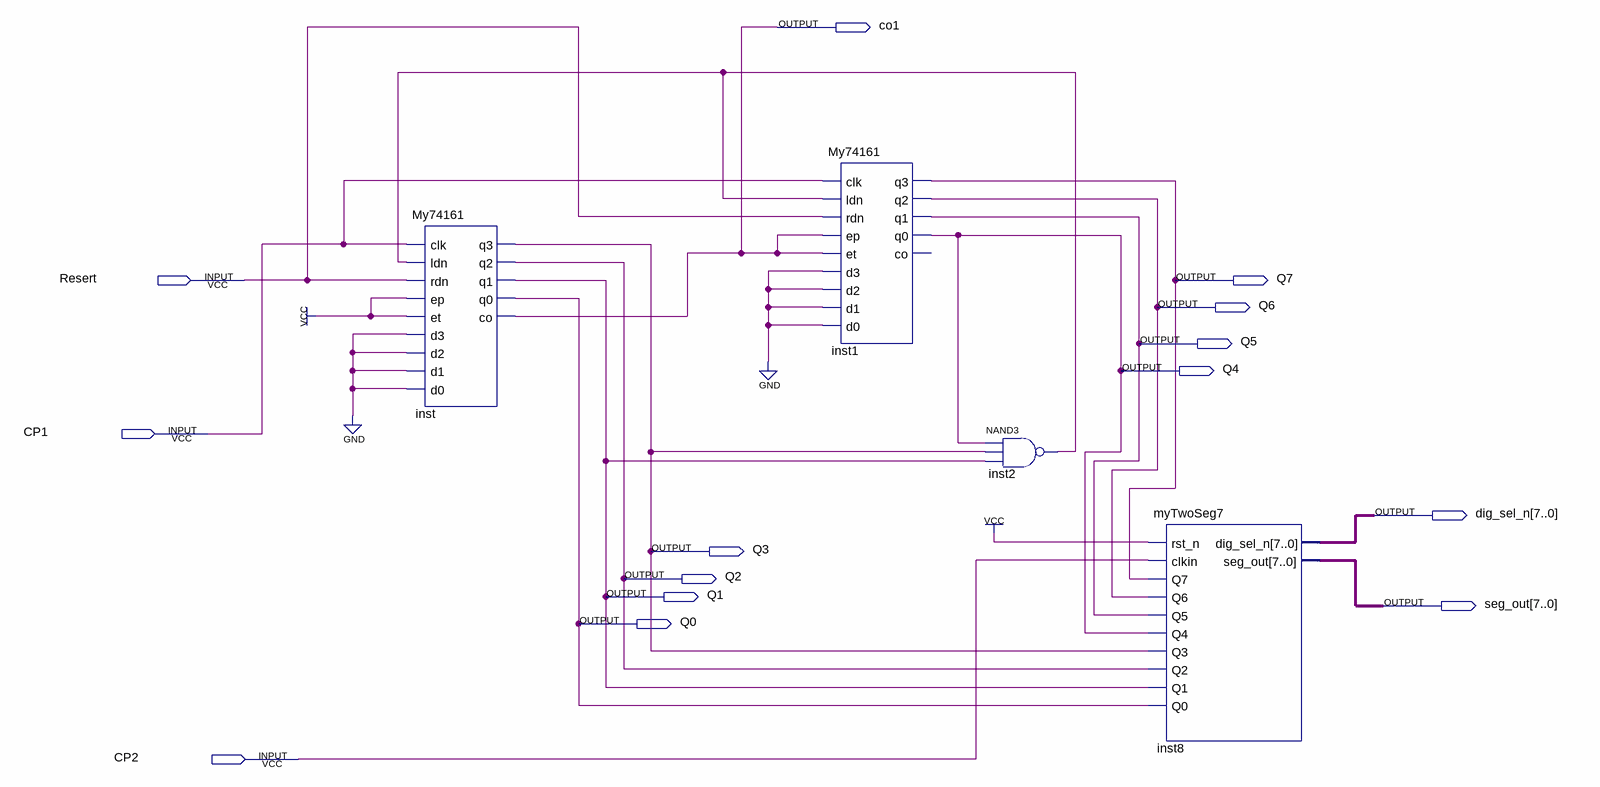
[diagram p0: schematic sheet]
// Quartus schematic exp3_4.bdf as structural Verilog: 4 symbols, 14 pins
module exp3_4 (
  input  Resert,
  input  CP1,
  input  CP2,
  output co1,
  output Q7,
  output Q6,
  output Q5,
  output Q4,
  output [7:0] dig_sel_n,
  output Q3,
  output Q2,
  output Q1,
  output [7:0] seg_out,
  output Q0
);

  wire inst2_out;

  My74161 inst (
    .clk(CP1), .ldn(inst2_out), .rdn(Resert), .ep(1'b1), .et(1'b1), .d3(1'b0), .d2(1'b0), .d1(1'b0),
    .d0(1'b0), .q3(Q3), .q2(Q2), .q1(Q1), .q0(Q0), .co(co1));
  My74161 inst1 (
    .clk(CP1), .ldn(inst2_out), .rdn(Resert), .ep(co1), .et(co1), .d3(1'b0), .d2(1'b0), .d1(1'b0), .d0(1'b0),
    .q3(Q7), .q2(Q6), .q1(Q5), .q0(Q4));  // open: co
  nand inst2 (inst2_out, Q4, Q3, Q1);
  myTwoSeg7 inst8 (
    .rst_n(1'b1), .clkin(CP2), .Q7(Q7), .Q6(Q6), .Q5(Q5), .Q4(Q4), .Q3(Q3), .Q2(Q2), .Q1(Q1), .Q0(Q0),
    .dig_sel_n(dig_sel_n), .seg_out(seg_out));
endmodule
